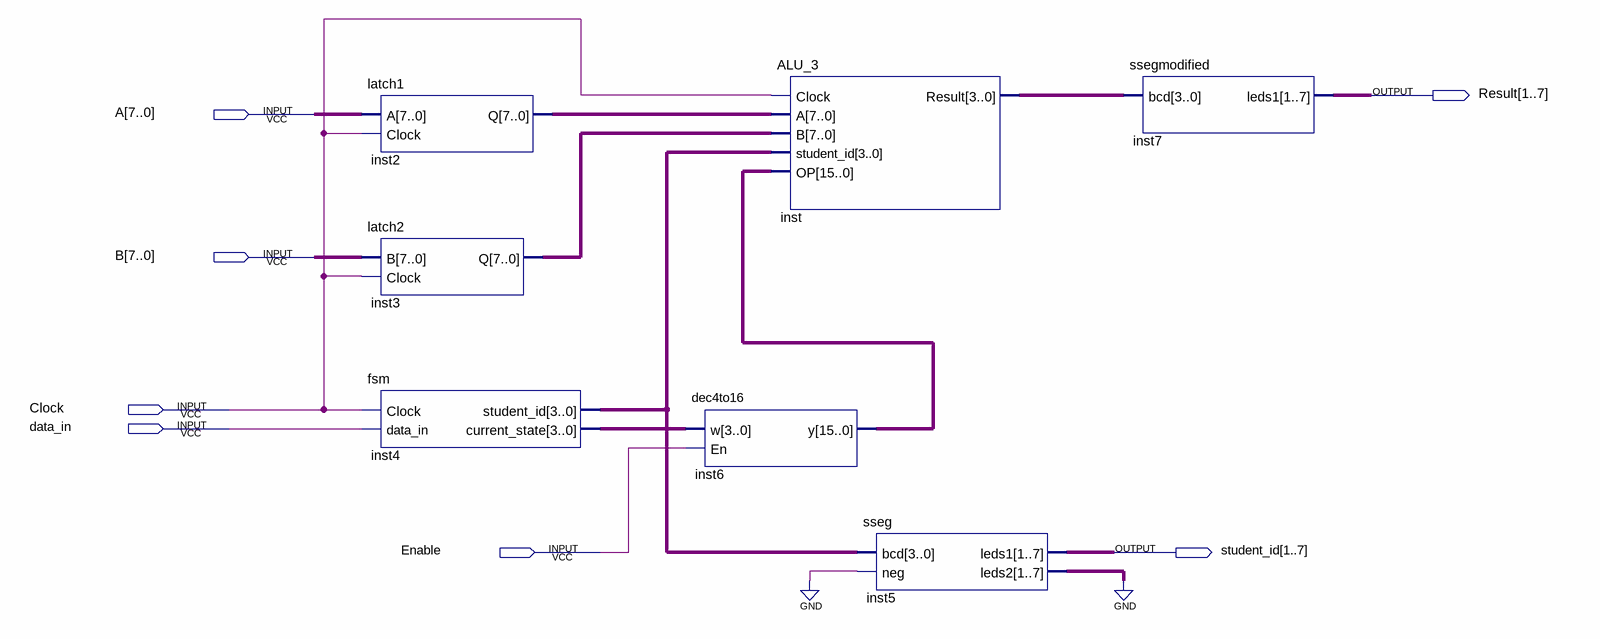
[diagram p0: schematic sheet]
// Quartus schematic ALU3_BlockDiagram.bdf as structural Verilog: 7 symbols, 7 pins
module ALU3_BlockDiagram (
  input  [7:0] A,
  input  [7:0] B,
  input  Clock,
  input  data_in,
  input  Enable,
  output [1:7] Result,
  output [1:7] student_id
);

  wire [3:0] inst4_current_state, inst4_student_id, inst_result;
  wire [6:0] inst5_leds2;
  wire [7:0] inst2_q, inst3_q;
  wire [15:0] inst6_y;

  latch1 inst2 (.A(A), .Clock(Clock), .Q(inst2_q));
  latch2 inst3 (.B(B), .Clock(Clock), .Q(inst3_q));
  fsm inst4 (.Clock(Clock), .data_in(data_in), .student_id(inst4_student_id), .current_state(inst4_current_state));
  dec4to16 inst6 (.w(inst4_current_state), .En(Enable), .y(inst6_y));
  ALU_3 inst (
    .Clock(Clock), .A(inst2_q), .B(inst3_q), .student_id(inst4_student_id), .OP(inst6_y), .Result(inst_result));
  sseg inst5 (.bcd(inst4_student_id), .neg(1'b0), .leds1(student_id), .leds2(inst5_leds2));
  ssegmodified inst7 (.bcd(inst_result), .leds1(Result));
  // also tied to GND on the sheet: {inst5_leds2[0], inst5_leds2[1], inst5_leds2[2], inst5_leds2[3], inst5_leds2[4], inst5_leds2[5], inst5_leds2[6]}
endmodule
